# EAGLE design swc_usb (EAGLE 7.5.0)
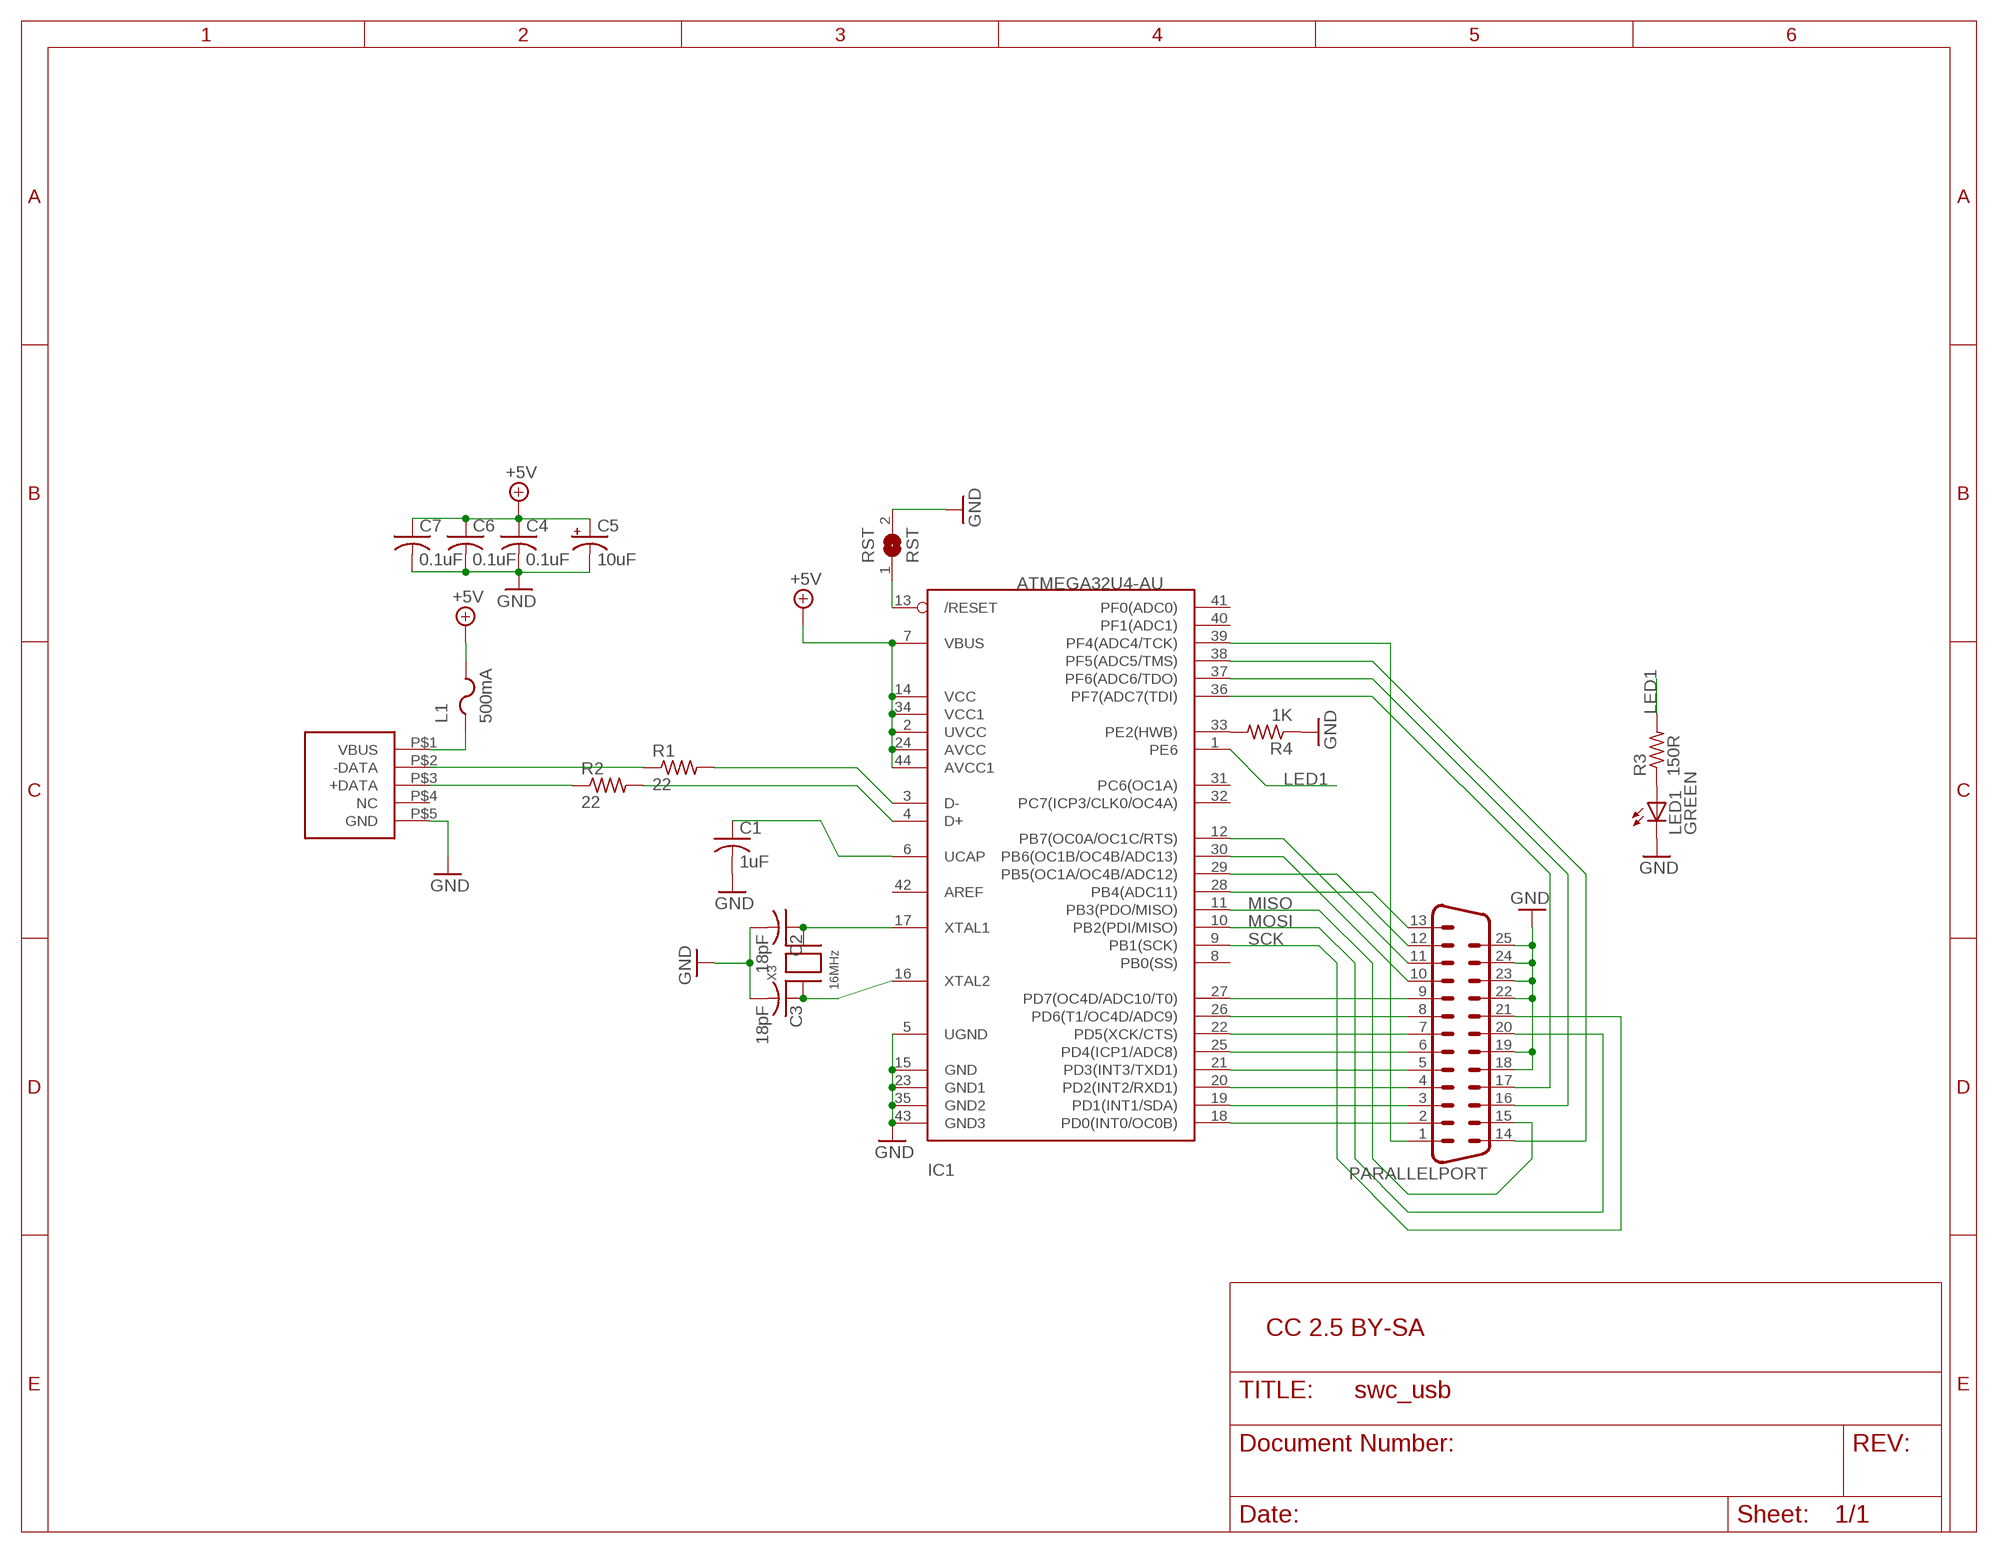
[diagram p0: schematic, sheet 1]

## Parts
C1  1uF  C-USC0805K  [C0805K]
C2  18pF  C-USC0805K  [C0805K]
C3  18pF  C-USC0805K  [C0805K]
C4  0.1uF  C-USC0805K  [C0805K]
C5  10uF  CPOL-USA/3216-18R  [A/3216-18R]
C6  0.1uF  C-USC0805K  [C0805K]
C7  0.1uF  C-USC0805K  [C0805K]
IC1  ATMEGA32U4-AU  [TQFP44]
L1  500mA  PTCFUSE-1206  [R1206]
LED1  GREEN  LED5MM  [LED5MM]
PARALLELPORT  M25D  [M25D]
R1  22  R-US_R0805  [R0805]
R2  22  R-US_R0805  [R0805]
R3  150R  R-US_R0805  [R0805]
R4  1K  R-US_R0805  [R0805]
RST  RST  SJ  [SJ]
U$1  MICRO_USB_MID  [MICRO_USB_MID]
X3  16MHz  XTALNX5032  [NX5032]

## Nets
+5V: C4.1 C5.+ C6.1 C7.1 IC1.2(UVCC) IC1.7(VBUS) IC1.14(VCC) IC1.24(AVCC) IC1.34(VCC1) IC1.44(AVCC1) L1.2
GND: C1.2 C2.2 C3.2 C4.2 C5.- C6.2 C7.2 IC1.5(UGND) IC1.15(GND) IC1.23(GND1) IC1.35(GND2) IC1.43(GND3) LED1.K(C) PARALLELPORT.18 PARALLELPORT.19 PARALLELPORT.22 PARALLELPORT.23 PARALLELPORT.24 PARALLELPORT.25 R4.1 RST.2 U$1.P$5(GND)
LED1: IC1.1(PE6) R3.2
MISO: IC1.11(PB3(PDO/MISO)) PARALLELPORT.15
MOSI: IC1.10(PB2(PDI/MISO)) PARALLELPORT.20
N$1: LED1.A R3.1
N$2: R2.1 U$1.P$3(+DATA)
N$3: IC1.3(D-) R1.2
N$4: IC1.4(D+) R2.2
N$5: R1.1 U$1.P$2(-DATA)
N$6: IC1.18(PD0(INT0/OC0B)) PARALLELPORT.2
N$7: IC1.19(PD1(INT1/SDA)) PARALLELPORT.3
N$8: C2.1 IC1.17(XTAL1) X3.P$2
N$9: C3.1 IC1.16(XTAL2) X3.P$1
N$10: C1.1 IC1.6(UCAP)
N$11: IC1.20(PD2(INT2/RXD1)) PARALLELPORT.4
N$12: IC1.21(PD3(INT3/TXD1)) PARALLELPORT.5
N$13: IC1.25(PD4(ICP1/ADC8)) PARALLELPORT.6
N$14: IC1.22(PD5(XCK/CTS)) PARALLELPORT.7
N$15: IC1.26(PD6(T1/OC4D/ADC9)) PARALLELPORT.8
N$16: IC1.27(PD7(OC4D/ADC10/T0)) PARALLELPORT.9
N$17: IC1.28(PB4(ADC11)) PARALLELPORT.13
N$18: IC1.29(PB5(OC1A/OC4B/ADC12)) PARALLELPORT.12
N$19: IC1.30(PB6(OC1B/OC4B/ADC13)) PARALLELPORT.10
N$20: IC1.12(PB7(OC0A/OC1C/RTS)) PARALLELPORT.11
N$24: IC1.39(PF4(ADC4/TCK)) PARALLELPORT.1
N$25: IC1.33(PE2(HWB)) R4.2
N$27: IC1.36(PF7(ADC7(TDI)) PARALLELPORT.17
N$28: IC1.37(PF6(ADC6/TDO)) PARALLELPORT.16
N$29: IC1.38(PF5(ADC5/TMS)) PARALLELPORT.14
RST: IC1.13(/RESET) RST.1
SCK: IC1.9(PB1(SCK)) PARALLELPORT.21
VBUS: L1.1 U$1.P$1(VBUS)
Unconnected: IC1.8(PB0(SS)) IC1.31(PC6(OC1A)) IC1.32(PC7(ICP3/CLK0/OC4A)) IC1.40(PF1(ADC1)) IC1.41(PF0(ADC0)) IC1.42(AREF) U$1.P$4(NC)

## Notes on the sheet
- CC 2.5 BY-SA

## Library data of the parts
C1 C4 C6 C7 = adafruit:C-US: CAPACITOR, American symbol; MF: WALSIN; MPN: 0805B104K500CT; OC_FARNELL: 2496944
C2 C3 = adafruit:C-US: CAPACITOR, American symbol; MF: WALSIN; MPN: 0805N180J500CT; OC_FARNELL: 2497020
C5 = adafruit:CPOL-US: POLARIZED CAPACITOR, American symbol; MF: WALSIN; MPN: 1206B106K160CT; OC_FARNELL: 2497081
IC1 = adaprog:ATMEGA32U4; MF: ATMEL; MPN: ATMEGA32U4-AU; OC_FARNELL: 1748525
L1 = adafruit:PTCFUSE: PTC fuses, resettable thermistors; MF: LITTELFUSE; MPN: 1206L050YR.; OC_FARNELL: 2119383
LED1 = adafruit:LED: LED OSRAM: - CHIPLED LG R971, LG N971, LY N971, LG Q971, LY Q971, LO R971, LY R971 LH N974, LH R974 LS Q976, LO Q976, LY Q976 LO Q996 - Hyper CHIPLED LW Q18S LB Q993, LB Q99A, LB R99A - SideLED LS A670, LO A670, LY A670, LG A670, LP A670 LB A673, LV A673, LT A673, LW A673 LH A674 LY A675 LS A676, LA A676, LO A676, LY A676, LW A676 LS A679, LY A679, LG A679 - Hyper Micro SIDELED® LS Y876, LA Y876, LO Y876, LY Y876 LT Y87S - SmartLED LW L88C, LW L88S LB L89C, LB L89S, LG L890 LS L89K, LO L89K, LY L89K LS L896, LA L896, LO L896, LY L896 - TOPLED LS T670, LO T670, LY T670, LG T670, LP T670 LSG T670, LSP T670, LSY T670, LOP T670, LYG T670 LG T671, LOG T671, LSG T671 LB T673, LV T673, LT T673, LW T673 LH T674 LS T676, LA T676, LO T676, LY T676, LB T676, LH T676, LSB T676, LW T676 LB T67C, LV T67C, LT T67C, LS T67K, LO T67K, LY T67K, LW E67C LS E67B, LA E67B, LO E67B, LY E67B, LB E67C, LV E67C, LT E67C LW T67C LS T679, LY T679, LG T679 LS T770, LO T770, LY T770, LG T770, LP T770 LB T773, LV T773, LT T773, LW T773 LH T774 LS E675, LA E675, LY E675, LS T675 LS T776, LA T776, LO T776, LY T776, LB T776 LHGB T686 LT T68C, LB T68C - Hyper Mini TOPLED® LB M676 - Mini TOPLED Santana® LG M470 LS M47K, LO M47K, LY M47K Source: http://www.osram.convergy.de/; MF: LUMEX; MPN: SSL-LX5093XAC; OC_FARNELL: 2062520
PARALLELPORT = con-subd-mod:M25: SUB-D; MF: ITW MCMURDO; MPN: SDB25PTD; OC_FARNELL: 150728; OC_NEWARK: unknown
R1 R2 = adafruit:R-US_: RESISTOR, American symbol; MF: WELWYN; MPN: WCR0805-22RFI; OC_FARNELL: 1099789
R3 = adafruit:R-US_: RESISTOR, American symbol; MF: WELWYN; MPN: WCR0805-150RFI; OC_FARNELL: 1099794
R4 = adafruit:R-US_: RESISTOR, American symbol; MF: YAGEO (PHYCOMP); MPN: RC0805FR-071KL; OC_FARNELL: 9237496
RST = jumper:SJ: SMD solder JUMPER; OC_FARNELL: unknown
U$1 = micro_usb_mid:MICRO_USB_MID; MF: MOLEX; MPN: 47491-0001; OC_FARNELL: 1568025
X3 = adaprog:XTAL; MF: EPSON; MPN: X1G0044510002 SG5032CAN 16 MHZ TJGA; OC_FARNELL: 2442979

## Board
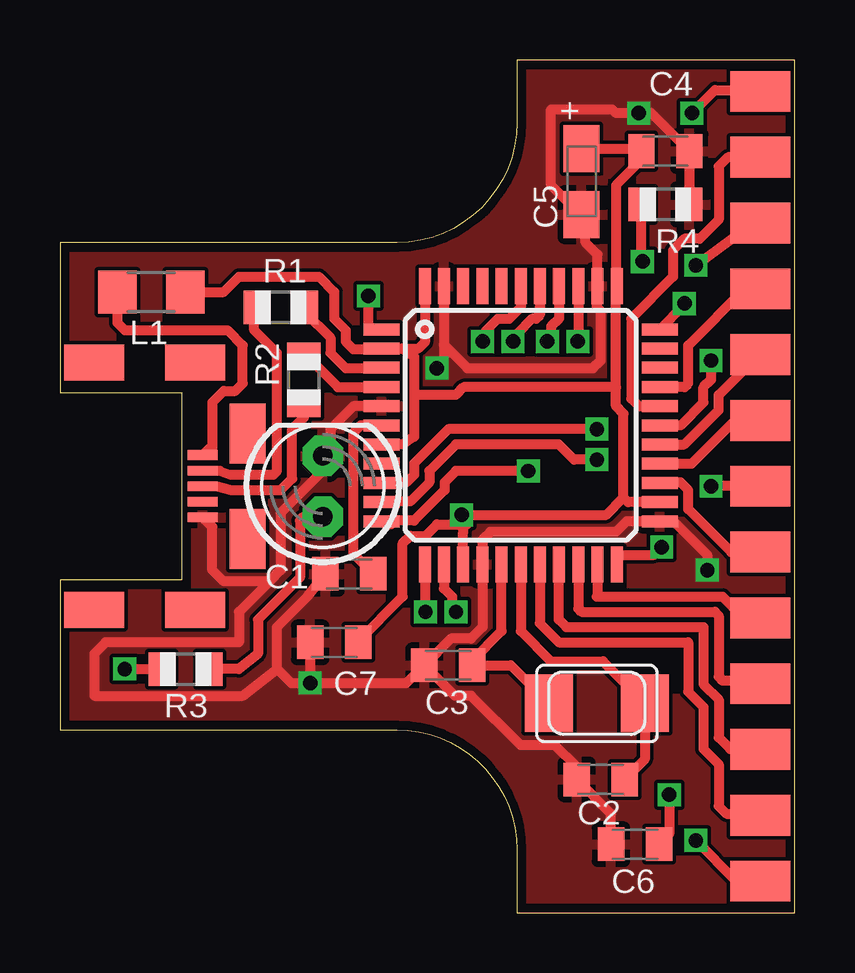
[diagram p1: board, top side]
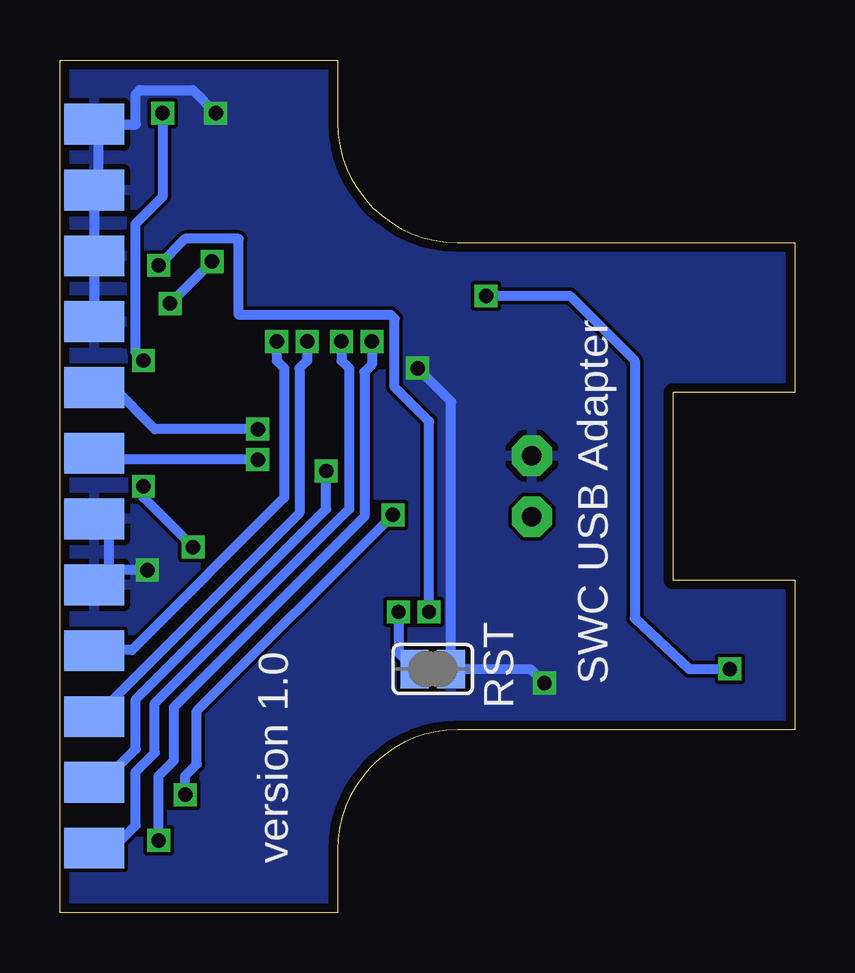
[diagram p2: board, bottom side, seen from below]

Size 30.63 x 35.55 mm. Coordinates in mm from the lower left corner, seen from the top.
Outline: 0,27.93 0,21.69 5.08,21.69 5.08,13.87 0,13.87 0,7.62 14.05,7.62 arc-90 19.05,2.62 19.05,0 30.63,0 30.63,35.55 19.05,35.55 19.05,32.94 arc-90 14.05,27.94 0,27.93
Copper layers (1*16): Top 0.0356mm / dielectric 1.5011mm / Bottom 0.0356mm
Design rules "LaenPCBOrder": minimum track width 6mil, minimum drill 13mil, track to track 6mil, track to pad 6mil, pad to pad 6mil, via to via 6mil, smd to smd 6mil, copper to edge 15mil, drill to drill 6mil, minimum pad ring 7mil, minimum via ring 7mil, stop-mask expansion 3mil, vias tented up to drill 0mil, thermal gap 10mil

### Footprints (pad centres in the part's own frame; a part is rotated, then mirrored left to right if it is on the bottom)
C0805K = smd 1.1 x 1.4: 1 -1,0; 2 1,0
A/3216-18R = smd 1.95 x 1.5: + 1.375,0; - -1.375,0
TQFP44 = smd 1.5 x 0.5: 1 -5.8,4; 2 -5.8,3.2; 3 -5.8,2.4; 4 -5.8,1.6; 5 -5.8,0.8; 6 -5.8,0; 7 -5.8,-0.8; 8 -5.8,-1.6; 9 -5.8,-2.4; 10 -5.8,-3.2; 11 -5.8,-4; 23 5.8,-4; 24 5.8,-3.2; 25 5.8,-2.4; 26 5.8,-1.6; 27 5.8,-0.8; 28 5.8,0; 29 5.8,0.8; 30 5.8,1.6; 31 5.8,2.4; 32 5.8,3.2; 33 5.8,4 | smd 0.5 x 1.5: 12 -4,-5.8; 13 -3.2,-5.8; 14 -2.4,-5.8; 15 -1.6,-5.8; 16 -0.8,-5.8; 17 0,-5.8; 18 0.8,-5.8; 19 1.6,-5.8; 20 2.4,-5.8; 21 3.2,-5.8; 22 4,-5.8; 34 4,5.8; 35 3.2,5.8; 36 2.4,5.8; 37 1.6,5.8; 38 0.8,5.8; 39 0,5.8; 40 -0.8,5.8; 41 -1.6,5.8; 42 -2.4,5.8; 43 -3.2,5.8; 44 -4,5.8
R1206 = smd 1.6 x 1.803: 1 -1.422,0; 2 1.422,0
LED5MM = drill 0.813 pad 1.676 octagon: A -1.27,0; K 1.27,0
M25D = smd 1.7 x 2.5: 1 16.459,-5.569; 2 13.716,-5.569; 3 10.973,-5.569; 4 8.23,-5.569; 5 5.486,-5.568; 6 2.743,-5.569; 7 0,-5.569; 8 -2.743,-5.569; 9 -5.486,-5.569; 10 -8.23,-5.568; 11 -10.973,-5.569; 12 -13.716,-5.569; 13 -16.459,-5.569 | smd 1.7 x 2.5 bottom: 14 15.088,-5.569; 15 12.344,-5.569; 16 9.601,-5.569; 17 6.858,-5.569; 18 4.115,-5.569; 19 1.372,-5.569; 20 -1.372,-5.569; 21 -4.115,-5.569; 22 -6.858,-5.569; 23 -9.601,-5.569; 24 -12.344,-5.569; 25 -15.088,-5.569
R0805 = smd 1.1 x 1.4: 1 -1,0; 2 1,0
SJ = smd 1.168 x 1.6: 1 -0.762,0; 2 0.762,0
MICRO_USB_MID = smd 1.25 x 0.4: P$1 0.875,1.3; P$2 0.875,0.65; P$3 0.875,0; P$4 0.875,-0.65; P$5 0.875,-1.3 | smd 2.5 x 1.5: P$20 -3.65,5.15; P$21 0.55,5.15; P$24 0.55,-5.15; P$25 -3.65,-5.15 | smd 1.5 x 2.5: P$22 2.75,2.2; P$23 2.75,-2.2
NX5032 = smd 2 x 2.4: P$1 2,0; P$2 -2,0

### Placement (x,y rotation side)
C1  12.07,14.13 180 top
C2  22.54,5.56 180 top
C3  16.19,10.32 180 top
C4  25.24,31.75 0 top
C5  21.75,30.48 90 top
C6  23.97,2.86 180 top
C7  11.43,11.27 180 top
IC1  19.21,20.32 0 top
L1  3.81,25.88 0 top
LED1  10.95,17.78 90 top
PARALLELPORT  34.77,17.78 270 top
R1  9.21,25.24 0 top
R2  10.16,22.22 90 top
R3  5.24,10.16 180 top
R4  25.24,29.53 180 top
RST  15.08,10.16 0 bottom
U$1  5.08,17.78 0 top
X3  22.38,8.73 180 top

### Tracks (layer width: path | path; a pad name or v marks a point on that pad's centre or on a via)
+5V  (via drill 0.6)
  Top 0.406: 13.25,23.5 IC1.2 | L1.2 6.83,25.88 7.46,26.51 10.8,26.51 11.43,25.88 11.43,24.77 11.91,24.29 11.91,23.81 12.22,23.5 13.23,23.5 IC1.2 | IC1.2 14.26,23.52 | 14.26,23.52 14.76,23.18 14.76,21.59 | 14.76,21.59 14.76,19.84 14.29,19.53 IC1.7 | 14.26,23.52 14.95,23.52 15.21,23.78 IC1.44 | IC1.24 23.68,17.12 23.5,17.3 | 23.5,17.3 23.5,20.8 23.18,21.11 23.18,21.91 | 23.18,21.91 23.18,26.09 IC1.34 23.18,26.15 23.18,30.32 24.24,31.39 C4.1 24.14,31.86 C5.+ | IC1.14 16.81,15.86 v16.75,16.59 | 23.18,21.91 16.83,21.91 16.51,21.59 14.76,21.59 | C7.1 12.43,11.32 14.29,13.18 14.29,15.4 14.61,15.72 15.24,15.72 15.72,16.19 16.99,16.19 v16.75,16.59 | v16.75,16.59 22.78,16.59 23.5,17.3 | v25.4,4.92 25.4,3.29 C6.1
  Bottom 0.406: v16.75,16.59 24.92,8.41 24.92,6.19 25.4,5.71 v25.4,4.92
GND  (via drill 0.6)
  Top 0.406: 8.73,13.81 9.21,14.29 9.21,16.67 10.95,18.42 LED1.K 11.27,19.37 11.27,20.16 12.23,21.12 IC1.5 | 8.73,13.81 6.83,13.81 6.35,14.29 6.35,16.09 U$1.P$5 | IC1.43 16.01,23.68 | 16.01,23.68 16.99,22.7 22.23,22.7 22.54,23.02 22.54,25.08 22.38,25.24 22.38,26.1 IC1.35 22.41,27.44 21.91,27.94 21.91,28.95 | 21.75,29.05 C5.- 21.91,28.95 | R4.1 C4.2 24.65,33.34 v24.13,33.34 23.18,33.34 23.02,33.5 20.48,33.5 20.48,30.32 21.85,28.95 21.91,28.95 | 8.73,13.81 7.46,12.54 7.46,11.27 1.91,11.27 1.43,10.79 1.43,9.05 7.62,9.05 9.05,10.16 | 9.05,10.16 9.05,11.91 10.32,13.18 C1.2 | 17.62,14.53 17.62,15.56 17.94,15.88 23.18,15.88 23.62,16.32 IC1.23 25.59,16.32 26.99,14.92 v26.99,14.29 | 17.62,14.53 IC1.15 | C7.2 v10.43,9.57 | 9.05,10.16 9.64,9.57 v10.43,9.57 | 16.01,23.68 16.01,23.15 v15.72,22.7 | C6.2 22.97,4.13 C2.2 21.54,6.08 20.64,6.98 19.21,6.98 17.15,9.05 16.46,9.05 C3.2 | 17.62,14.53 17.62,11.91 17.15,11.43 16.3,11.43 C3.2 | v10.43,9.57 14.45,9.57 C3.2
  Bottom 0.406: PARALLELPORT.25 29.04,32.7 | 29.04,32.7 28.88,32.86 27.46,32.86 27.46,34.13 27.31,34.29 25.08,34.29 v24.13,33.34 | 29.04,32.7 29.04,30.29 PARALLELPORT.24 PARALLELPORT.23 PARALLELPORT.22 | v26.99,14.29 28.58,14.29 | 28.58,14.29 PARALLELPORT.18 | 28.58,14.29 28.58,15.79 PARALLELPORT.19 | v10.43,9.57 11.02,10.16 RST.2 14.32,21.3 v15.72,22.7
  pour Bottom: -3.97,39.21 30.64,39.21 30.64,-8.41 -5.56,-8.41 -5.56,-5.87 -3.97,-5.87
  pour Top: -2.54,40.64 31.43,40.64 31.43,-9.05 -2.54,-9.05
LED1  (via drill 0.6)
  Top 0.406: IC1.1 12.86,24.29 v12.86,25.72 | v2.7,10.16 R3.2
  Bottom 0.406: v12.86,25.72 9.37,25.72 6.67,23.02 6.67,12.27 4.4,10.16 v2.7,10.16
MISO  (via drill 0.6)
  Top 0.406: 13.81,16.19 IC1.11 13.44,16.35 14.76,16.35 16.03,17.62 16.03,17.94 16.51,18.42 v19.53,18.42
  Bottom 0.406: 29.16,5.4 PARALLELPORT.15 28.85,5.44 27.46,6.83 27.46,8.89 19.53,16.83 v19.53,18.42
MOSI  (via drill 0.6)
  Top 0.406: v22.38,18.89 21.43,18.89 20.8,19.53 16.51,19.53 15.4,18.42 15.4,17.94 14.61,17.14 13.43,17.14 IC1.10
  Bottom 0.406: 29.1,19.05 PARALLELPORT.20 28.94,18.89 v22.38,18.89
N$1
  Top 0.406: LED1.A 10.16,16.51 10,16.35 10,13.97 8.26,12.22 8.26,10.79 7.46,10.16 R3.1
N$2
  Top 0.406: U$1.P$3 6.51,17.78 7.14,17.62 9.21,17.62 9.68,18.1 9.68,20.16 10.16,20.64 R2.1
N$3
  Top 0.406: R1.2 10.21,25.04 11.27,23.97 11.27,23.34 11.91,22.7 13.23,22.7 IC1.3
N$4
  Top 0.406: R2.2 10.27,23.22 11.59,21.91 13.24,21.91 IC1.4
N$5
  Top 0.406: U$1.P$2 6.65,18.43 6.67,18.42 7.14,18.26 8.89,18.26 9.05,18.42 9.05,23.34 8.1,24.29 8.1,25.13 R1.1
N$6
  Top 0.406: PARALLELPORT.2 28.64,4.06 28.58,4.13 27.78,4.13 27.46,4.45 27.46,6.19 26.83,6.83 26.83,8.57 26.19,9.21 26.19,11.27 20.8,11.27 20,12.07 IC1.18
N$7
  Top 0.406: IC1.19 20.8,14.51 20.8,12.22 21.11,11.91 26.83,11.91 26.83,9.53 27.46,8.89 27.46,7.3 27.94,6.83 29.18,6.83 PARALLELPORT.3
N$8
  Top 0.406: X3.P$2 23.65,9.53 | IC1.17 19.21,11.75 20.48,10.48 22.64,10.48 X3.P$2 | X3.P$2 24.38,6.4 C2.1
N$9
  Top 0.406: X3.P$1 18.8,10.32 C3.1 17.19,10.53 18.42,11.75 IC1.16
N$10
  Top 0.406: IC1.6 12.54,20.32 12.22,20 12.22,14.97 C1.1
N$11
  Top 0.406: IC1.20 21.61,12.68 21.75,12.54 27.31,12.54 27.46,12.38 27.46,9.84 27.62,9.68 29.07,9.68 PARALLELPORT.4
N$12
  Top 0.406: IC1.21 22.41,13.2 22.38,13.18 27.62,13.18 28.42,12.38 29.11,12.38 PARALLELPORT.5
N$13
  Top 0.406: PARALLELPORT.6 27.98,15.04 26.19,16.83 26.19,17.62 25.88,17.94 25.03,17.94 IC1.25
N$14  (via drill 0.6)
  Top 0.406: PARALLELPORT.7 v27.15,17.78 | IC1.22 23.21,14.92 24.77,14.92 v25.08,15.24
  Bottom 0.406: v27.15,17.78 27.15,17.3 v25.08,15.24
N$15
  Top 0.406: IC1.26 26.34,18.72 28.1,20.48 29.16,20.48 PARALLELPORT.8
N$16
  Top 0.406: IC1.27 26.03,19.52 27.46,20.96 27.46,21.59 28.73,22.86 28.8,22.86 PARALLELPORT.9
N$17  (via drill 0.6)
  Top 0.406: 28.78,33.81 PARALLELPORT.13 29.15,34.29 27.31,34.29 v26.35,33.34 | v27.15,23.02 27.15,22.22 26.83,21.91 26.83,21.27 25.88,20.32 IC1.28
  Bottom 0.406: v27.15,23.02 27.46,23.34 27.46,28.73 26.35,29.85 v26.35,33.34
N$18
  Top 0.406: PARALLELPORT.12 27.84,31.5 27.46,31.11 27.46,28.89 26.67,28.1 26.04,28.1 25.56,27.62 25.56,26.51 23.81,24.77 23.81,21.43 24.13,21.11 IC1.29
N$19
  Top 0.406: 29.19,26.01 PARALLELPORT.10 29.18,26.04 28.58,26.04 26.19,23.65 26.19,22.07 26.04,21.91 25.02,21.91 IC1.30
N$20  (via drill 0.6)
  Top 0.406: PARALLELPORT.11 28.91,28.75 v26.51,26.99 | v15.24,12.54 15.24,14.49 IC1.12
  Bottom 0.406: v15.24,12.54 15.24,20.48 16.67,21.91 16.67,24.77 16.83,24.92 23.18,24.92 23.18,28.1 25.4,28.1 v26.51,26.99
N$24  (via drill 0.6)
  Top 0.406: v17.62,23.81 17.78,24.29 18.26,24.77 18.73,24.77 19.21,25.24 IC1.39 | PARALLELPORT.1 28.21,1.32 v26.51,3.02
  Bottom 0.406: v17.62,23.81 17.62,22.86 17.94,22.54 17.94,16.51 25.88,8.57 25.88,6.35 26.51,5.71 v26.51,3.02
N$25  (via drill 0.6)
  Top 0.406: 25.04,24.29 IC1.33 26.04,25.35 v26.04,25.4 | v24.29,27.15 24.24,27.19 R4.2
  Bottom 0.406: v26.04,25.4 v24.29,27.15
N$27  (via drill 0.6)
  Top 0.406: 21.59,26.12 IC1.36 21.61,23.83 v21.59,23.81
  Bottom 0.406: PARALLELPORT.17 29.17,10.95 27.62,10.95 21.27,17.3 21.27,22.7 21.59,23.02 v21.59,23.81
N$28  (via drill 0.6)
  Top 0.406: IC1.37 20.81,24.78 20.48,24.45 20.48,23.97 v20.32,23.81
  Bottom 0.406: v20.32,23.81 20.32,23.02 20.64,22.7 20.64,16.67 26.99,10.32 28.26,9.05 29.13,8.18 PARALLELPORT.16
N$29  (via drill 0.6)
  Top 0.406: IC1.38 20.01,25.25 20,25.24 20,24.92 19.84,24.77 19.69,24.77 19.05,24.13 v18.89,23.81
  Bottom 0.406: PARALLELPORT.14 28.42,2.7 27.46,3.65 27.46,5.87 26.67,6.67 26.67,8.73 18.57,16.83 18.57,22.7 18.89,23.02 v18.89,23.81
RST  (via drill 0.6)
  Top 0.406: IC1.13 16.01,13.52 16.35,13.18 16.35,12.7 v16.51,12.54
  Bottom 0.406: v16.51,12.54 16.51,10.83 RST.1
SCK  (via drill 0.6)
  Top 0.406: v22.38,20.16 16.19,20.16 14.76,18.73 14.76,18.26 14.45,17.94 13.43,17.94 IC1.9
  Bottom 0.406: PARALLELPORT.21 29.19,21.91 28.42,21.91 26.67,20.16 v22.38,20.16
VBUS
  Top 0.406: L1.1 2.39,24.6 2.7,24.29 6.98,24.29 7.62,23.65 7.62,22.07 7.3,21.75 6.83,21.75 6.35,21.27 6.35,19.37 6.24,19.37 U$1.P$1

### Text on the board
bPlace: SWC USB Adapter | version 1.0